# EAGLE design rev_1 (EAGLE 5.10)
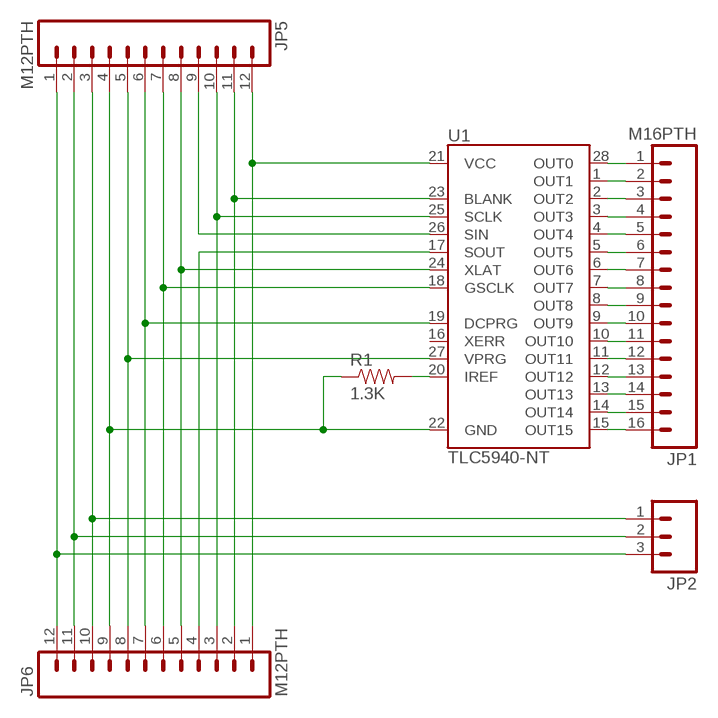
[diagram p0: schematic, sheet 1]

## Parts
JP1  M16PTH  [1X16]
JP2  M03PTH  [1X03]
JP5  M12PTH  [1X12]
JP6  M12PTH  [1X12]
R1  1.3K  RESISTORPTH-1/6W  [1/6W-RES]
U1  TLC5940-NT  [DIL28-3]

## Nets
5V: JP5.12 JP6.1 U1.21(VCC)
BLANK: JP5.11 JP6.2 U1.23(BLANK)
DCPRG: JP5.6 JP6.7 U1.19(DCPRG)
GND: JP5.4 JP6.9 R1.1 U1.22(GND)
GSCLK: JP5.7 JP6.6 U1.18(GSCLK)
N$1: JP6.4 U1.17(SOUT)
N$2: R1.2 U1.20(IREF)
N$3: JP2.3 JP5.1 JP6.12
N$4: JP5.5 JP6.8 U1.27(VPRG)
N$5: JP2.2 JP5.2 JP6.11
N$6: JP2.1 JP5.3 JP6.10
N$7: JP1.1 U1.28(OUT0)
N$8: JP1.2 U1.1(OUT1)
N$9: JP1.3 U1.2(OUT2)
N$10: JP1.4 U1.3(OUT3)
N$11: JP1.5 U1.4(OUT4)
N$12: JP1.6 U1.5(OUT5)
N$13: JP1.7 U1.6(OUT6)
N$14: JP1.8 U1.7(OUT7)
N$15: JP1.9 U1.8(OUT8)
N$16: JP1.10 U1.9(OUT9)
N$17: JP5.9 U1.26(SIN)
N$20: JP1.11 U1.10(OUT10)
N$21: JP1.12 U1.11(OUT11)
N$22: JP1.13 U1.12(OUT12)
N$23: JP1.14 U1.13(OUT13)
N$24: JP1.15 U1.14(OUT14)
N$25: JP1.16 U1.15(OUT15)
SCLK: JP5.10 JP6.3 U1.25(SCLK)
XLAT: JP5.8 JP6.5 U1.24(XLAT)
Unconnected: U1.16(XERR)

## Library data of the parts
JP1 = SparkFun:M16
JP2 = SparkFun:M03: Header 3 Standard 3-pin 0.1" header. Use with straight break away headers (SKU : PRT-00116), right angle break away headers (PRT-00553), swiss pins (PRT-00743), machine pins (PRT-00117), and female headers (PRT-00115). Molex polarized connector foot print use with SKU : PRT-08232 with associated crimp pins and housings.
JP5 JP6 = SparkFun:M12: Header 12 Standard 12-pin 0.1" header. Use with straight break away headers (SKU : PRT-00116), right angle break away headers (PRT-00553), swiss pins (PRT-00743), machine pins (PRT-00117), and female headers (PRT-00115).
R1 = SparkFun:RESISTOR: Resistor Basic schematic elements and footprints for 0603, 1206, and PTH resistors.
U1 = SparkFun:TLC5940: TI TLC5940 16-channel LED Driver with Dot Correction and Grayscale PWM Control The TLC5940 is a 16-channel, constant-current sink LED driver. Each channel has an individually adjustable 4096-step grayscale PWM brightness control and a 64-step, constant-current sink (dot correction). The dot correction adjusts the brightness variations between LED channels and other LED drivers. The dot correction data is stored in an integrated EEPROM. Both grayscale control and dot correction are accessible via a serial interface. A single external resistor sets the maximum current value of all 16 channels. Packages: 28-pin HTSSOP 32-pin 5x5mm QFN 28-pin DIP

## Board
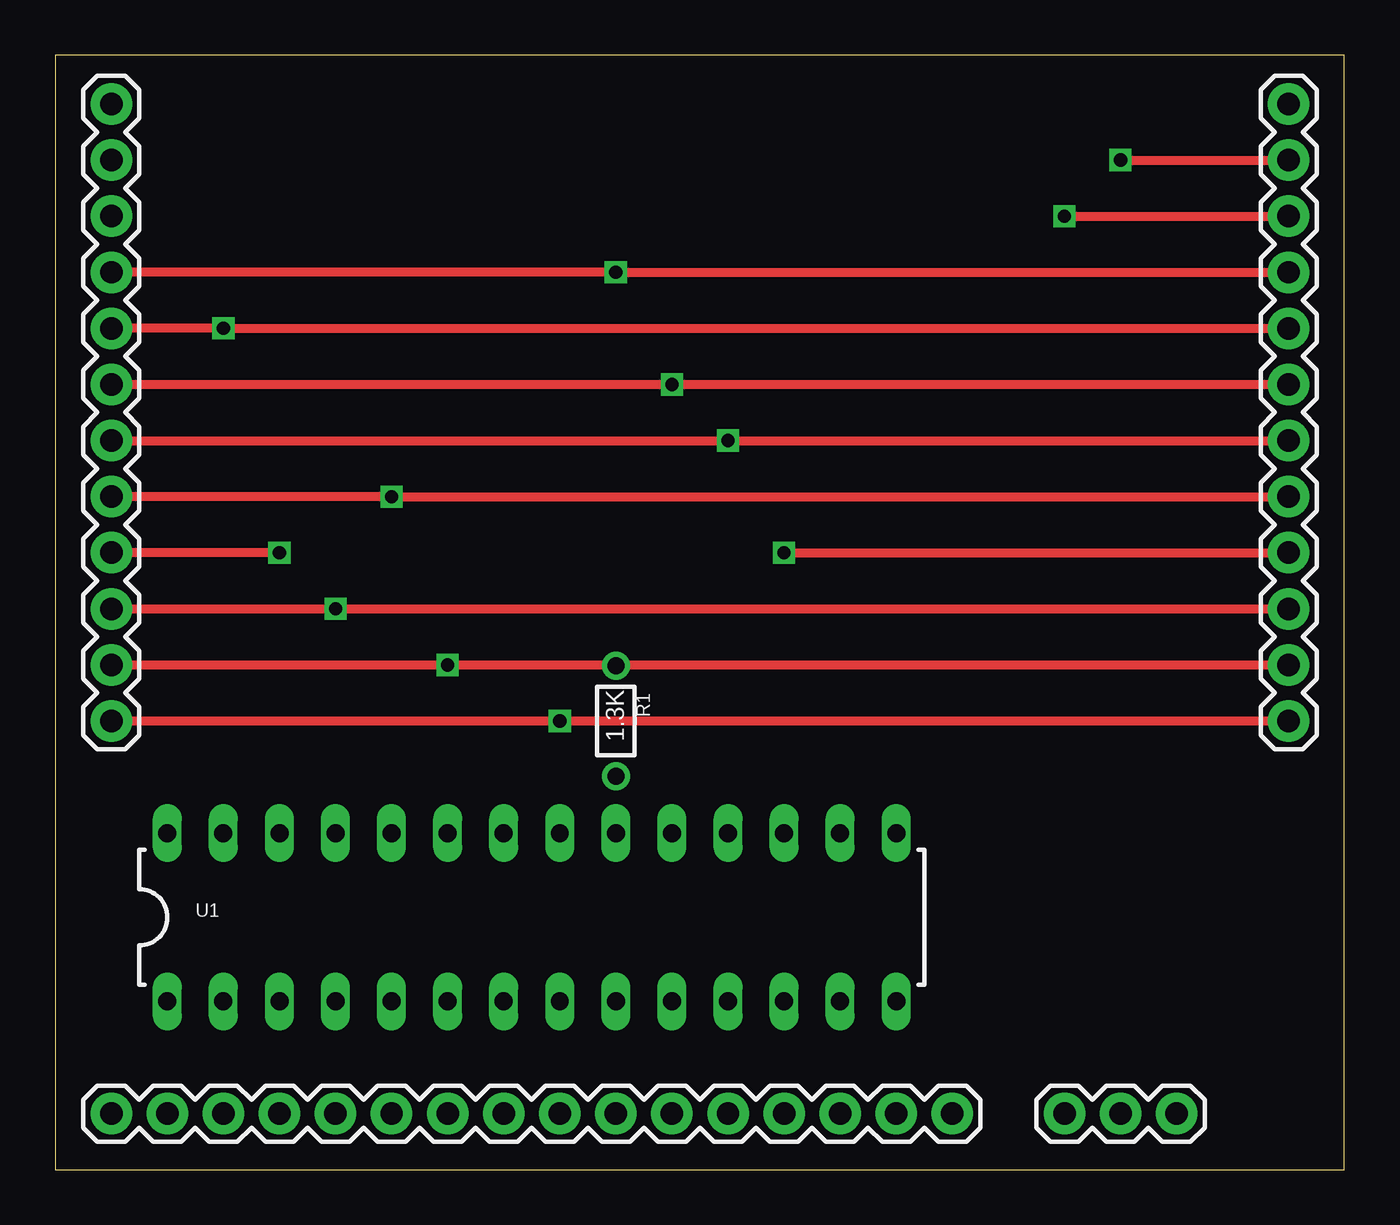
[diagram p1: board, top side]
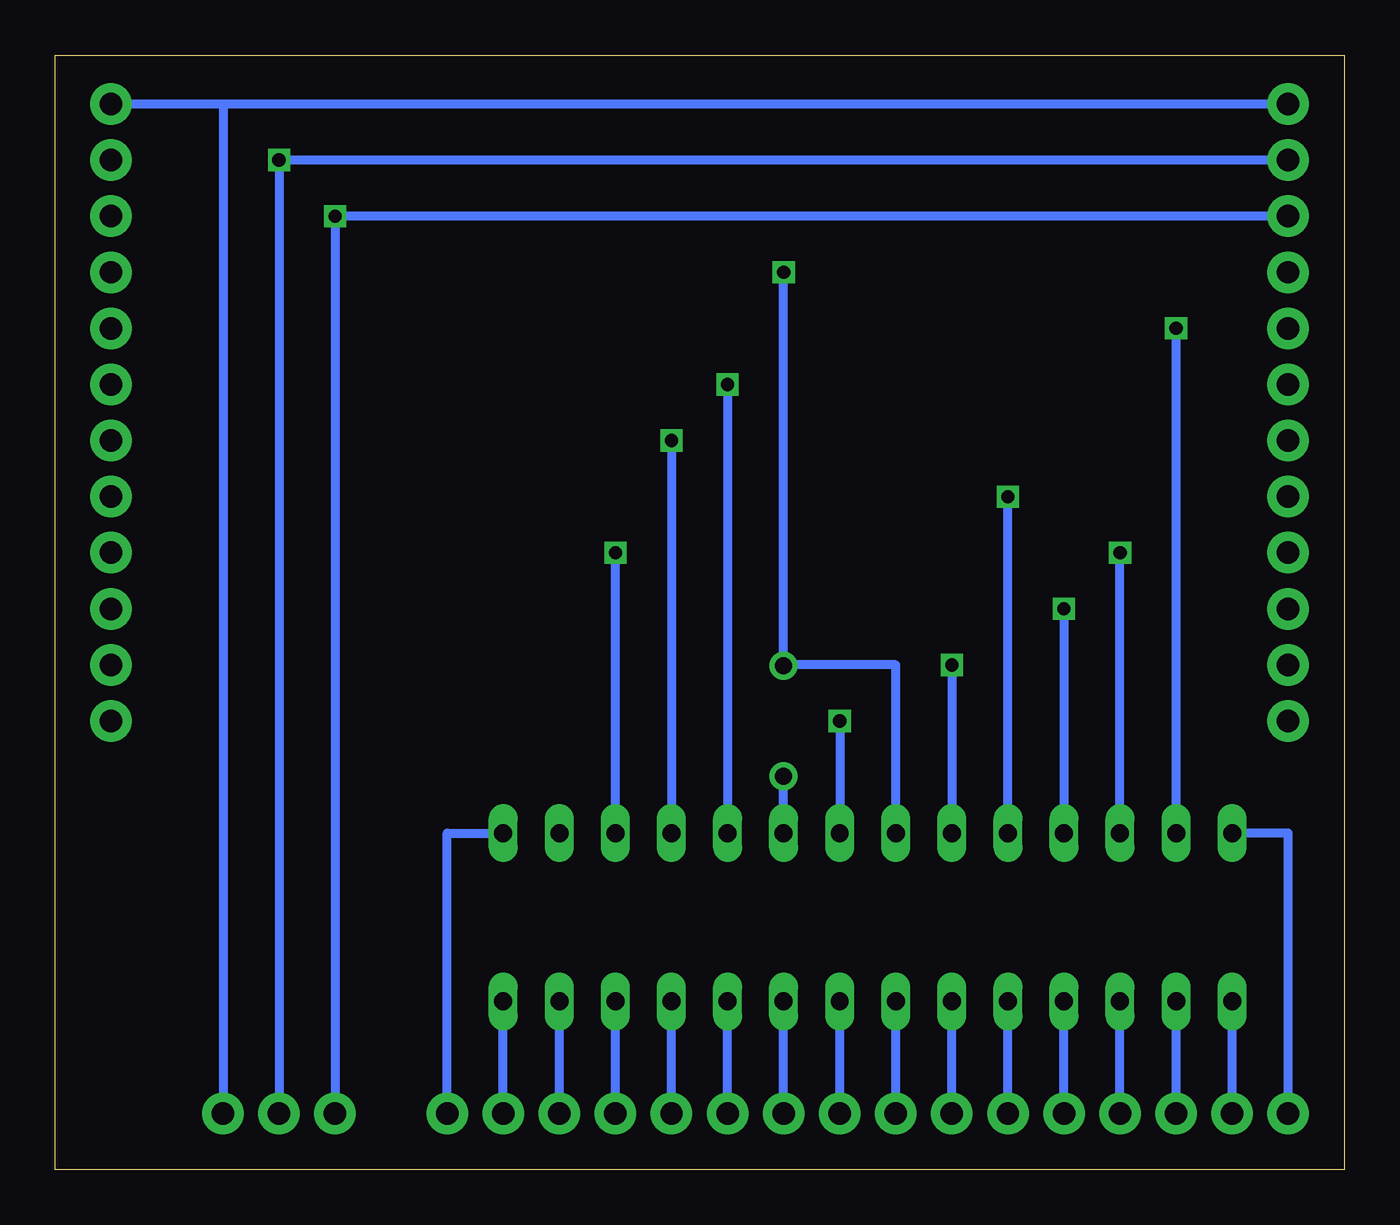
[diagram p2: board, bottom side, seen from below]

Size 58.4 x 50.47 mm. Coordinates in mm from the lower left corner, seen from the top.
Outline: 0,0 58.4,0 58.4,50.47 0,50.47 0,0
Copper layers (1*16): Top 0.035mm / dielectric 1.5mm / Bottom 0.035mm
Design rules "default": minimum track width 10mil, minimum drill 24mil, track to track 8mil, track to pad 8mil, pad to pad 8mil, via to via 8mil, smd to smd 8mil, copper to edge 40mil, drill to drill 8mil, minimum pad ring 10mil, minimum via ring 8mil, stop-mask expansion 4mil, vias tented up to drill 0mil, thermal gap 10mil

### Footprints (pad centres in the part's own frame; a part is rotated, then mirrored left to right if it is on the bottom)
1X16 = drill 1.016 pad 1.88 round: 1 0,0; 2 2.54,0; 3 5.08,0; 4 7.62,0; 5 10.16,0; 6 12.7,0; 7 15.24,0; 8 17.78,0; 9 20.32,0; 10 22.86,0; 11 25.4,0; 12 27.94,0; 13 30.48,0; 14 33.02,0; 15 35.56,0; 16 38.1,0
1X03 = drill 1.016 pad 1.88 round: 1 0,0; 2 2.54,0; 3 5.08,0
1X12 = drill 1.016 pad 1.88 round: 1 0,0; 2 2.54,0; 3 5.08,0; 4 7.62,0; 5 10.16,0; 6 12.7,0; 7 15.24,0; 8 17.78,0; 9 20.32,0; 10 22.86,0; 11 25.4,0; 12 27.94,0
1/6W-RES = drill 0.762 round: 1 -2.5,0; 2 2.5,0
DIL28-3 = drill 0.813 long: 1 -16.51,-3.81; 2 -13.97,-3.81; 3 -11.43,-3.81; 4 -8.89,-3.81; 5 -6.35,-3.81; 6 -3.81,-3.81; 7 -1.27,-3.81; 8 1.27,-3.81; 9 3.81,-3.81; 10 6.35,-3.81; 11 8.89,-3.81; 12 11.43,-3.81; 13 13.97,-3.81; 14 16.51,-3.81; 15 16.51,3.81; 16 13.97,3.81; 17 11.43,3.81; 18 8.89,3.81; 19 6.35,3.81; 20 3.81,3.81; 21 1.27,3.81; 22 -1.27,3.81; 23 -3.81,3.81; 24 -6.35,3.81; 25 -8.89,3.81; 26 -11.43,3.81; 27 -13.97,3.81; 28 -16.51,3.81

### Placement (x,y rotation side)
JP1  2.54,2.54 0 top
JP2  45.72,2.54 0 top
JP5  2.54,48.26 270 top
JP6  55.88,20.32 90 top
R1  25.4,20.32 270 top
U1  21.59,11.43 0 top

### Tracks (layer width: path | path; a pad name or v marks a point on that pad's centre or on a via)
5V  (via drill 0.6)
  Top 0.406: JP5.12 v22.86,20.32 JP6.1
  Bottom 0.406: v22.86,20.32 U1.21
BLANK  (via drill 0.6)
  Top 0.406: JP5.11 v17.78,22.86 JP6.2
  Bottom 0.406: v17.78,22.86 U1.23
DCPRG  (via drill 0.6)
  Top 0.406: JP6.7 v27.94,35.56 JP5.6
  Bottom 0.406: v27.94,35.56 U1.19
GND  (via drill 0.6)
  Top 0.406: JP5.4 v25.4,40.64 JP6.9
  Bottom 0.406: U1.22 20.32,22.86 25.4,22.86 R1.1 v25.4,40.64
GSCLK  (via drill 0.6)
  Top 0.406: JP6.6 v30.48,33.02 JP5.7
  Bottom 0.406: v30.48,33.02 U1.18
N$1  (via drill 0.6)
  Top 0.406: v33.02,27.94 JP6.4
  Bottom 0.406: U1.17 v33.02,27.94
N$2
  Bottom 0.406: U1.20 R1.2
N$3
  Bottom 0.406: 50.8,48.26 JP2.3 | 50.8,48.26 JP6.12 | JP5.1 50.8,48.26
N$4  (via drill 0.6)
  Top 0.406: JP5.5 v7.62,38.1 JP6.8
  Bottom 0.406: U1.27 v7.62,38.1
N$5  (via drill 0.6)
  Top 0.406: v48.26,45.72 JP6.11
  Bottom 0.406: JP2.2 v48.26,45.72 JP5.2
N$6  (via drill 0.6)
  Top 0.406: v45.72,43.18 JP6.10
  Bottom 0.406: JP2.1 v45.72,43.18 JP5.3
N$7
  Bottom 0.406: U1.28 2.54,15.24 JP1.1
N$8
  Bottom 0.406: JP1.2 U1.1
N$9
  Bottom 0.406: JP1.3 U1.2
N$10
  Bottom 0.406: JP1.4 U1.3
N$11
  Bottom 0.406: JP1.5 U1.4
N$12
  Bottom 0.406: JP1.6 U1.5
N$13
  Bottom 0.406: JP1.7 U1.6
N$14
  Bottom 0.406: JP1.8 U1.7
N$15
  Bottom 0.406: JP1.9 U1.8
N$16
  Bottom 0.406: JP1.10 U1.9
N$17  (via drill 0.6)
  Top 0.406: v10.16,27.94 JP5.9
  Bottom 0.406: U1.26 v10.16,27.94
N$20
  Bottom 0.406: JP1.11 U1.10
N$21
  Bottom 0.406: JP1.12 U1.11
N$22
  Bottom 0.406: JP1.13 U1.12
N$23
  Bottom 0.406: JP1.14 U1.13
N$24
  Bottom 0.406: JP1.15 U1.14
N$25
  Bottom 0.406: U1.15 40.64,15.24 JP1.16
SCLK  (via drill 0.6)
  Top 0.406: JP5.10 v12.7,25.4 JP6.3
  Bottom 0.406: v12.7,25.4 U1.25
XLAT  (via drill 0.6)
  Top 0.406: JP5.8 v15.24,30.48 JP6.5
  Bottom 0.406: U1.24 v15.24,30.48